# Altium schematic sheet MMA8452QT_I2C.SchDoc
size A4
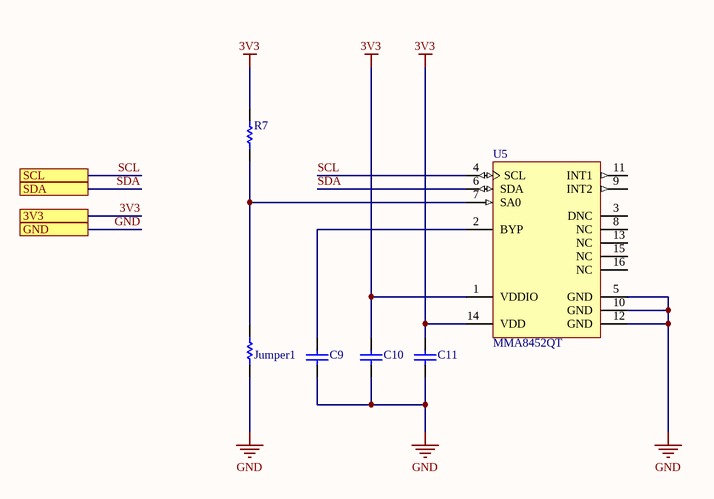
[diagram p0: MMA8452QT_I2C.SchDoc]

## Parts
C9  C0805C104J5RAC7800  [CAPC2013X145X50NL20T25]  (value not drawn)
C10  C0805C104J5RAC7800  [CAPC2013X145X50NL20T25]  (value not drawn)
C11  08053D475KAT2A  [CAPC2013X140X50NL20T25]  (value not drawn)
Jumper1  (no value)  [RESC2013X60X40NL20T25_A]
R7  RK73B2ATTD103J  [RESC2013X60X30NL20T20]  (value not drawn)
U5  MMA8452QT  [FRES-SOT1676-1_V]

## Ports
3V3, GND, SCL, SDA

## Nets
3V3: C10.2 C11.2 R7.2 U5.1(VDDIO) U5.14(VDD) ; port 3V3
GND: C9.1 C10.1 C11.1 Jumper1.1 U5.5(GND) U5.10(GND) U5.12(GND) ; port GND
SCL: U5.4(SCL) ; port SCL
SDA: U5.6(SDA) ; port SDA
NetC9_2: C9.2 U5.2(BYP)
NetJumper1_2: Jumper1.2 R7.1 U5.7(SA0)

Not connected (* = marked no-connect by the designer): U5 3(DNC) 8(NC) 9(INT2) 11(INT1) 13(NC) 15(NC) 16(NC)

## Library data of the parts
C9 C10 = CMP-2007-01102-1: 0.1µF ±5% 50V Ceramic Capacitor X7R 0805 (2012 Metric); Manufacturer: Kemet; Part Number: C0805C104J5RAC7800
C11 = CMP-2007-04614-1: 4.7µF ±10% 25V Ceramic Capacitor X5R 0805 (2012 Metric); Manufacturer: AVX Interconnect / Elco; Part Number: 08053D475KAT2A
Jumper1 = CMP-2000-06228-1: Tolerance: 0.1%; Voltage Rating: 100V; Power Rating: 125mW(1/8W); Brand: Panasonic; Temperature Coefficient: 25PPM/C; Resistance: 10kOhms; Product Category: ThinFilmResistors-SMD; Operating Temperature Range: -55Cto+155C; Length: 2mm; Mounting Technology: SurfaceMount; Manufacturer URL: http://www.panasonic.com/; Width: 1.25mm; Packaging: Reel; Product: ThinFilmResistorsSMD; Package / Case: 0805(2012metric); Termination Style: SMD/SMT; Package Description: 2-Pin Surface Mount Device, Body 2 x 1.25 mm; Factory Pack Quantity: 5000; Series: ERA-6A; Case Code - mm: 2012; RoHS: Details; Package Reference: 0805; Height: 0.5mm; Manufacturer: Panasonic; Case Code - in: 0805; Type: MetalFilmChipResistors
R7 = CMP-2001-04657-1: 10 kOhms ±5% 0.25W, 1/4W Chip Resistor 0805 (2012 Metric) Automotive AEC-Q200, Moisture Resistant Thick Film; Manufacturer: KOA Speer; Part Number: RK73B2ATTD103J
U5 = CMP-2000-06726-1: 3-Axis, 12-Bit / 8-Bit Digital Accelerometer, 1.95 to 3.6 V, -40 to 85 degC, 16-Pin QFN (SOT1676-1), RoHS, Tray; Manufacturer: Freescale; Maximum Frequency Response: 400kHz; Frequency Response Range: 0→400kHz; Noise: 99µg/√Hz; Sensitivity: 256counts/g,512counts/g,1024counts/g; Interface Type: Serial-I2C; Minimum Operating Supply Voltage: 1.95V; Operating Supply Voltage Range: 1.95→3.6V; Package Version: Rev. B, 01/2016; Minimum Frequency Response: 0kHz; Maximum Operating Supply Voltage: 3.6V; Number of Axis: 3; Sensor Range: ±2g,±4g,±8g; Technology: Digital; Minimum Operating Temperature: -40°C; Mounting Type: SurfaceMount; Datasheet URL: http://cache.nxp.com/files/sensors/doc/data_sheet/MMA8452Q.pdf?fpsp=1&WT_TYPE=Data%20Sheets&WT_VENDOR=FREESCALE&WT_FILE_FORMAT=pdf&WT_ASSET=Documentation&fileExt=.pdf; Operating Temperature Range: -40→+85°C; Height: 1mm; Package Description: 16-Pin Quad Flat No-lead Package, Body 3 x 3 mm, Pitch 0.5 mm; Dimensions: 3x3x1mm; Mounting Technology: SurfaceMount; Pin Count: 16; Package Type: QFN; Length: 3mm; Datasheet Version: Rev. 10, 04/2016; Package Reference: SOT1676-1; Width: 3mm; Maximum Operating Temperature: +85°C; Package URL: http://cache.freescale.com/files/shared/doc/package_info/98ASA00063D.pdf; Manufacturer URL: http://www.nxp.com/